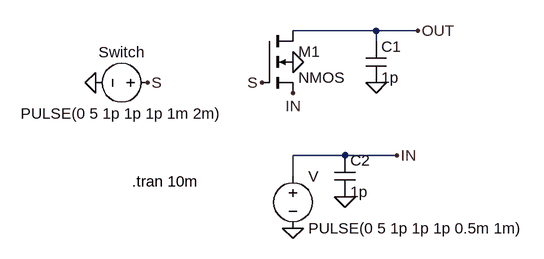
[diagram p0: schematic pass_ttr.asc]
pass_ttr.asc, the LTspice schematic file:
Version 4
SHEET 1 880 680
WIRE 272 80 144 80
WIRE 336 80 272 80
WIRE 272 96 272 80
WIRE 224 272 144 272
WIRE 304 272 224 272
WIRE 144 304 144 272
FLAG 336 80 OUT
FLAG -160 160 0
FLAG 144 384 0
FLAG 144 128 0
FLAG 272 160 0
FLAG 224 336 0
FLAG -80 160 S
FLAG 96 160 S
FLAG 304 272 IN
FLAG 144 176 IN
SYMBOL voltage -64 160 R90
WINDOW 0 -32 56 VBottom 2
WINDOW 3 32 56 VTop 2
WINDOW 123 0 0 Left 0
WINDOW 39 0 0 Left 0
SYMATTR InstName Switch
SYMATTR Value PULSE(0 5 1p 1p 1p 1m 2m)
SYMBOL voltage 144 288 R0
WINDOW 123 0 0 Left 0
WINDOW 39 0 0 Left 0
SYMATTR InstName V
SYMATTR Value PULSE(0 5 1p 1p 1p 0.5m 1m)
SYMBOL nmos4 96 80 R0
SYMATTR InstName M1
SYMBOL cap 256 96 R0
SYMATTR InstName C1
SYMATTR Value 1p
SYMBOL cap 208 272 R0
SYMATTR InstName C2
SYMATTR Value 1p
TEXT -104 312 Left 2 !.tran 10m

The netlist it stands for:
* pass_ttr.asc
V§Switch S 0 PULSE(0 5 1p 1p 1p 1m 2m)
V IN 0 PULSE(0 5 1p 1p 1p 0.5m 1m)
M1 OUT S IN 0 NMOS
C1 OUT 0 1p
C2 IN 0 1p
.model NMOS NMOS
.model PMOS PMOS
.lib standard.mos
.tran 10m
.backanno
.end